# EAGLE design untitled (EAGLE 9.6.2)
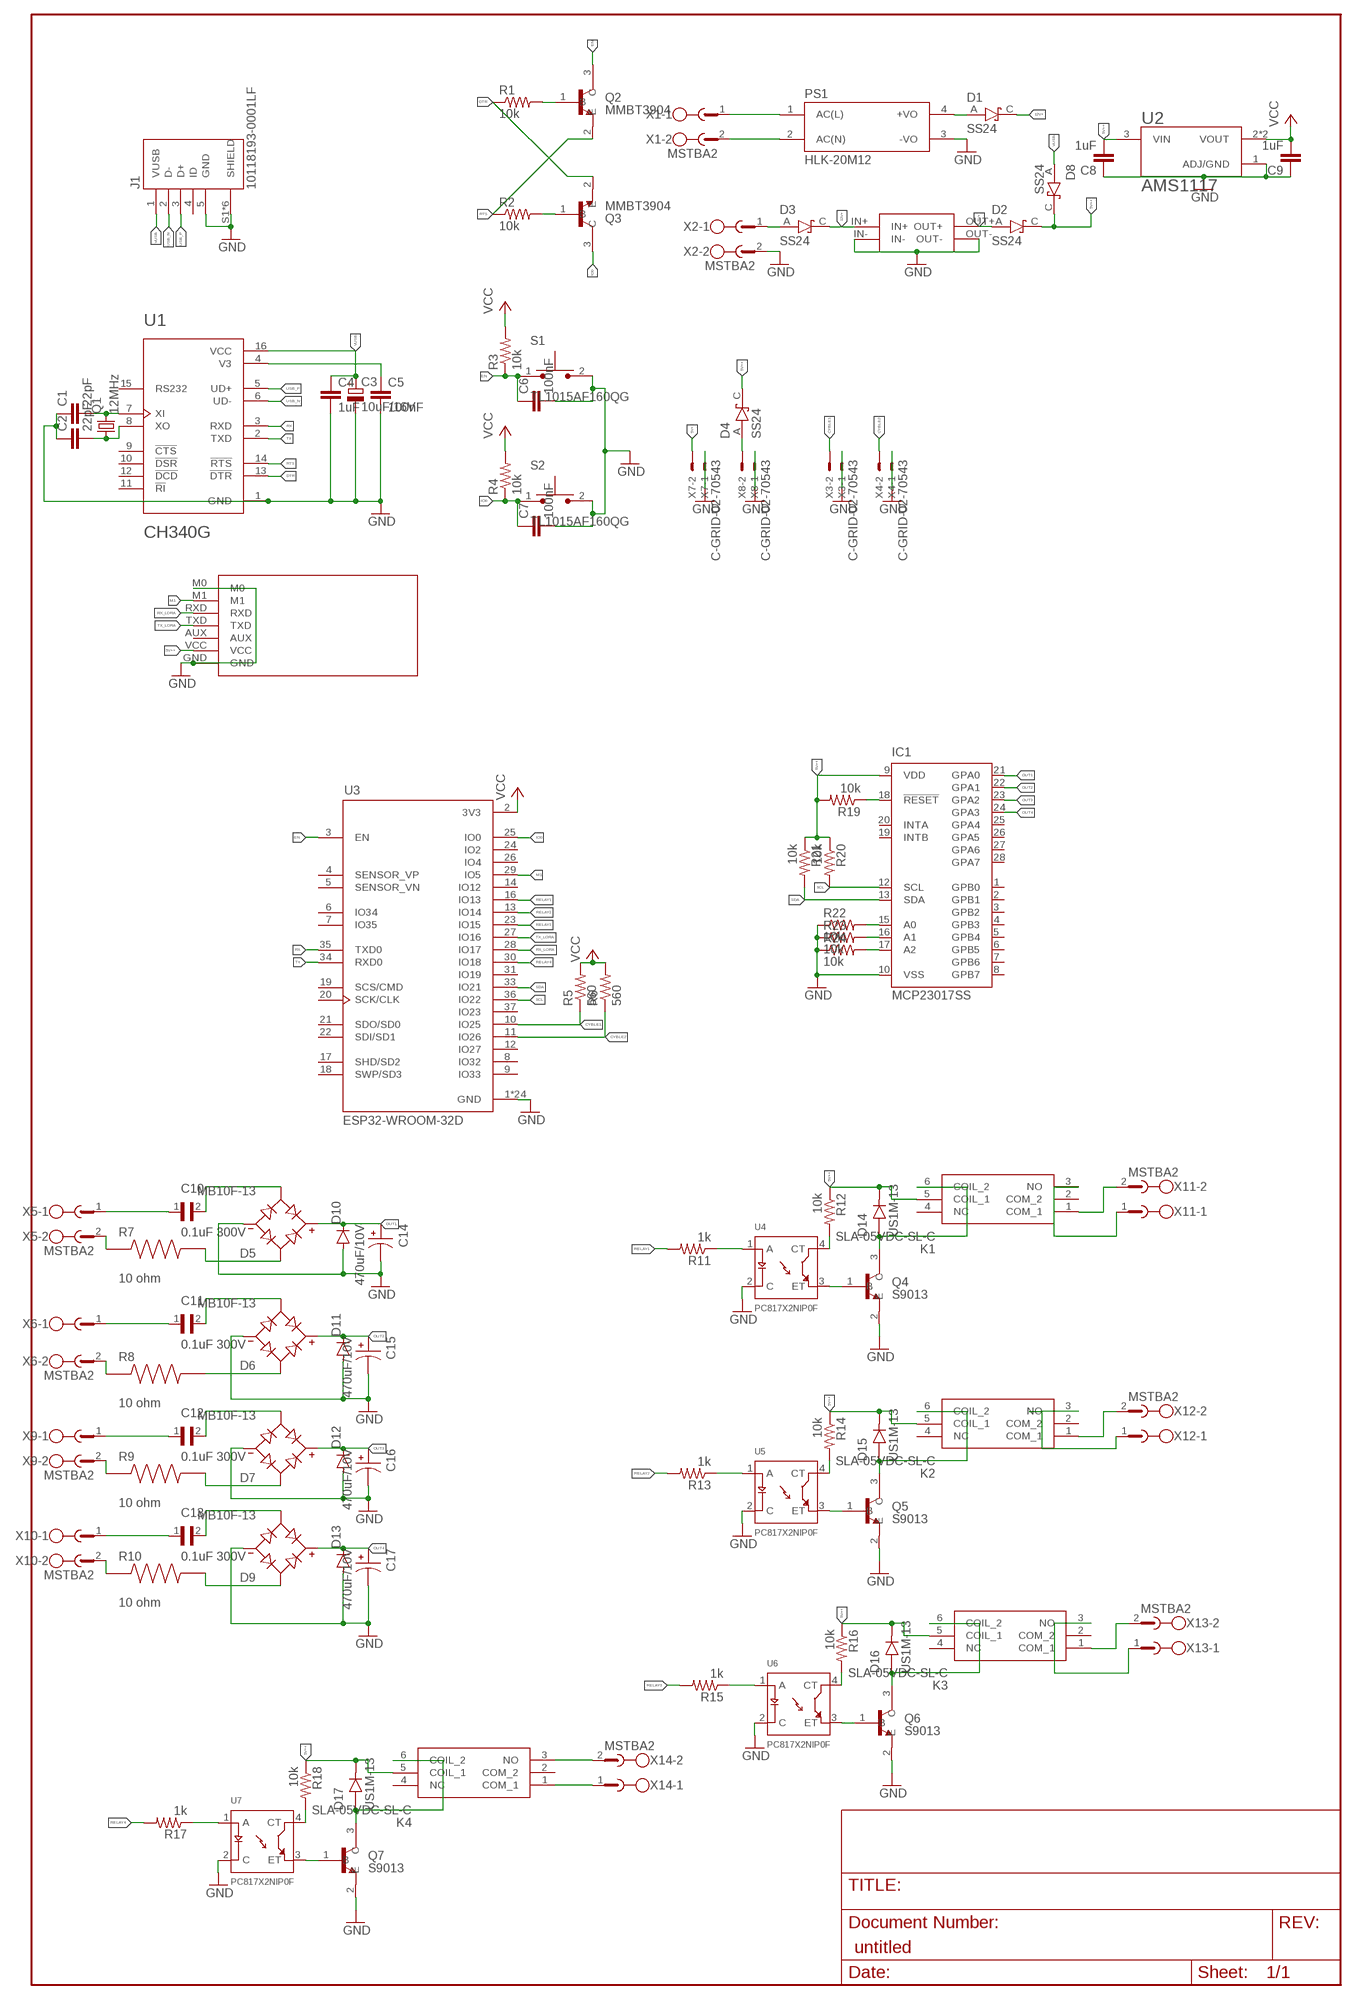
[diagram p0: schematic, sheet 1]

## Parts
C1  22pF  C-EUC0805K  [C0805K]
C2  22pF  C-EUC0805K  [C0805K]
C3  10uF/16V  CPOL-EU153CLV-0505  [153CLV-0505]
C4  1uF  C-EUC0805K  [C0805K]
C5  100nF  C-EUC0805K  [C0805K]
C6  100nF  C-EUC0805K  [C0805K]
C7  100nF  C-EUC0805K  [C0805K]
C8  1uF  C-EUC0805K  [C0805K]
C9  1uF  C-EUC0805K  [C0805K]
C10  0.1uF 300V  ECQUAAF104KA  [CAPRR1500W60L1750T500H1200]
C11  0.1uF 300V  ECQUAAF104KA  [CAPRR1500W60L1750T500H1200]
C12  0.1uF 300V  ECQUAAF104KA  [CAPRR1500W60L1750T500H1200]
C13  0.1uF 300V  ECQUAAF104KA  [CAPRR1500W60L1750T500H1200]
C14  470uF/10V  EEEFC1A471AP  [CAP_EEEFC1A471AP]
C15  470uF/10V  EEEFC1A471AP  [CAP_EEEFC1A471AP]
C16  470uF/10V  EEEFC1A471AP  [CAP_EEEFC1A471AP]
C17  470uF/10V  EEEFC1A471AP  [CAP_EEEFC1A471AP]
D1  SS24  [DIOM5336X265N]
D2  SS24  [DIOM5336X265N]
D3  SS24  [DIOM5336X265N]
D4  SS24  [DIOM5336X265N]
D5  MB10F-13  [DIOB_MB10F-13]
D6  MB10F-13  [DIOB_MB10F-13]
D7  MB10F-13  [DIOB_MB10F-13]
D8  SS24  [DIOM5336X265N]
D9  MB10F-13  [DIOB_MB10F-13]
D10  DIODE-SOD123  [SOD123]
D11  DIODE-SOD123  [SOD123]
D12  DIODE-SOD123  [SOD123]
D13  DIODE-SOD123  [SOD123]
D14  US1M-13  [DIOM5226X240N]
D15  US1M-13  [DIOM5226X240N]
D16  US1M-13  [DIOM5226X240N]
D17  US1M-13  [DIOM5226X240N]
EBYTEE220-900T22D1  EBYTEE220-900T22D  [EBYTEE220-900T22D]
IC1  MCP23017SS  [SSOP28]
J1  10118193-0001LF  [FCI_10118193-0001LF]
K1  SLA-05VDC-SL-C  [SLA05VDCSLC]
K2  SLA-05VDC-SL-C  [SLA05VDCSLC]
K3  SLA-05VDC-SL-C  [SLA05VDCSLC]
K4  SLA-05VDC-SL-C  [SLA05VDCSLC]
MINI1  MINI560  [MINI560]
PS1  HLK-20M12  [CONV_HLK-20M12]
Q1  12MHz  CRYSTALSM49  [SM49]
Q2  MMBT3904  [SOT95P240X120-3N]
Q3  MMBT3904  [SOT95P240X120-3N]
Q4  S9013  [SOT95P240X120-3N]
Q5  S9013  [SOT95P240X120-3N]
Q6  S9013  [SOT95P240X120-3N]
Q7  S9013  [SOT95P240X120-3N]
R1  10k  R-US_M0805  [M0805]
R2  10k  R-US_M0805  [M0805]
R3  10k  R-US_M0805  [M0805]
R4  10k  R-US_M0805  [M0805]
R5  560  R-US_M0805  [M0805]
R6  560  R-US_M0805  [M0805]
R7  10 ohm  ERJP14J200U  [RES_ERJP14J200U]
R8  10 ohm  ERJP14J200U  [RES_ERJP14J200U]
R9  10 ohm  ERJP14J200U  [RES_ERJP14J200U]
R10  10 ohm  ERJP14J200U  [RES_ERJP14J200U]
R11  1k  R-US_M0805  [M0805]
R12  10k  R-US_M0805  [M0805]
R13  1k  R-US_M0805  [M0805]
R14  10k  R-US_M0805  [M0805]
R15  1k  R-US_M0805  [M0805]
R16  10k  R-US_M0805  [M0805]
R17  1k  R-US_M0805  [M0805]
R18  10k  R-US_M0805  [M0805]
R19  10k  R-US_M0805  [M0805]
R20  10k  R-US_M0805  [M0805]
R21  10k  R-US_M0805  [M0805]
R22  10k  R-US_M0805  [M0805]
R23  10k  R-US_M0805  [M0805]
R24  10k  R-US_M0805  [M0805]
S1  TL1015AF160QG  [SW_TL1015AF160QG]
S2  TL1015AF160QG  [SW_TL1015AF160QG]
U1  CH340G  [SOIC127P600X180-16N]
U2  AMS1117  [SOT229P700X180-4N]
U3  ESP32-WROOM-32D  [MODULE_ESP32-WROOM-32D]
U4  PC817X2NIP0F  [SOT254P975X400-4N]
U5  PC817X2NIP0F  [SOT254P975X400-4N]
U6  PC817X2NIP0F  [SOT254P975X400-4N]
U7  PC817X2NIP0F  [SOT254P975X400-4N]
X1  MSTBA2  [MSTBA2]
X2  MSTBA2  [MSTBA2]
X3  C-GRID-02-70543  [70543-02]
X4  C-GRID-02-70543  [70543-02]
X5  MSTBA2  [MSTBA2]
X6  MSTBA2  [MSTBA2]
X7  C-GRID-02-70543  [70543-02]
X8  C-GRID-02-70543  [70543-02]
X9  MSTBA2  [MSTBA2]
X10  MSTBA2  [MSTBA2]
X11  MSTBA2  [MSTBA2]
X12  MSTBA2  [MSTBA2]
X13  MSTBA2  [MSTBA2]
X14  MSTBA2  [MSTBA2]

## Nets
5V+: D2.A MINI1.OUT+ X7.2
5V++: C8.2 D2.C(K) D4.C(K) D8.C(K) D14.C(K) D15.C(K) D16.C(K) D17.C(K) EBYTEE220-900T22D1.VCC IC1.9(VDD) K1.5(COIL_1) K2.5(COIL_1) K3.5(COIL_1) K4.5(COIL_1) R12.1 R14.1 R16.1 R18.1 R19.2 R20.1 R21.1 U2.3(VIN)
12V+: D1.C(K) D3.C(K) MINI1.IN+
CYBLE1: R5.1 U3.10(IO25) X3.2
CYBLE2: R6.1 U3.11(IO26) X4.2
DTR: Q3.2(E) R1.1 U1.13(!DTR)
EN: C6.1 Q2.3(C) R3.1 S1.1 U3.3(EN)
GND: C1.1 C2.1 C3.- C4.2 C5.2 C6.2 C7.2 C8.1 C9.1 C14.2 C15.2 C16.2 C17.2 D5.3(-) D6.3(-) D7.3(-) D9.3(-) D10.A D11.A D12.A D13.A EBYTEE220-900T22D1.GND EBYTEE220-900T22D1.M0 IC1.10(VSS) J1.5(GND) J1.S1(SHIELD) J1.S2(SHIELD) J1.S3(SHIELD) J1.S4(SHIELD) J1.S5(SHIELD) J1.S6(SHIELD) MINI1.IN- MINI1.OUT- PS1.3(-VO) Q4.2(E) Q5.2(E) Q6.2(E) Q7.2(E) R22.1 R23.1 R24.1 S1.2 S2.2 U1.1(GND) U2.1(ADJ/GND) U3.1(GND) U3.15(GND) U3.38(GND) U3.39_1(GND) U3.39_2(GND) U3.39_3(GND) U3.39_4(GND) U3.39_5(GND) U3.39_6(GND) U3.39_7(GND) U3.39_8(GND) U3.39_9(GND) U3.39_10(GND) U3.39_11(GND) U3.39_12(GND) U3.39_13(GND) U3.39_14(GND) U3.39_15(GND) U3.39_16(GND) U3.39_17(GND) U3.39_18(GND) U3.39_19(GND) U3.39_20(GND) U3.39_21(GND) U4.2(C) U5.2(C) U6.2(C) U7.2(C) X2.2 X3.1 X4.1 X7.1 X8.1
IO0: C7.1 Q3.3(C) R4.1 S2.1 U3.25(IO0)
M1: EBYTEE220-900T22D1.M1 U3.29(IO5)
N$1: PS1.1(AC(L)) X1.1
N$2: C5.1 U1.4(V3)
N$3: Q2.1(B) R1.2
N$4: C1.2 Q1.2 U1.7(XI)
N$5: C2.2 Q1.1 U1.8(XO)
N$6: Q3.1(B) R2.2
N$7: PS1.2(AC(N)) X1.2
N$8: C10.1 X5.1
N$9: D1.A PS1.4(+VO)
N$10: D3.A X2.1
N$11: C11.1 X6.1
N$12: D4.A X8.2
N$13: C12.1 X9.1
N$14: C13.1 X10.1
N$15: C10.2 D5.4(AC2)
N$16: C11.2 D6.4(AC2)
N$17: C12.2 D7.4(AC2)
N$18: C13.2 D9.4(AC2)
N$19: R11.1 U4.1(A)
N$20: Q4.1(B) U4.3(ET)
N$21: R12.2 U4.4(CT)
N$22: K1.1(COM_1) X11.2
N$23: K1.3(NO) X11.1
N$24: D14.A K1.6(COIL_2) Q4.3(C)
N$25: IC1.18(!RESET) R19.1
N$26: R13.1 U5.1(A)
N$27: R10.1 X10.2
N$28: R9.1 X9.2
N$29: R8.1 X6.2
N$30: R7.1 X5.2
N$31: D9.2(AC1) R10.2
N$32: D7.2(AC1) R9.2
N$33: D6.2(AC1) R8.2
N$34: D5.2(AC1) R7.2
N$35: Q5.1(B) U5.3(ET)
N$36: R14.2 U5.4(CT)
N$37: D15.A K2.6(COIL_2) Q5.3(C)
N$38: K2.1(COM_1) X12.2
N$39: K2.3(NO) X12.1
N$40: IC1.15(A0) R22.2
N$41: R15.1 U6.1(A)
N$42: Q6.1(B) U6.3(ET)
N$43: R16.2 U6.4(CT)
N$44: D16.A K3.6(COIL_2) Q6.3(C)
N$45: K3.1(COM_1) X13.2
N$46: K3.3(NO) X13.1
N$47: IC1.16(A1) R23.2
N$48: R17.1 U7.1(A)
N$49: Q7.1(B) U7.3(ET)
N$50: R18.2 U7.4(CT)
N$51: D17.A K4.6(COIL_2) Q7.3(C)
N$52: K4.3(NO) X14.2
N$53: K4.1(COM_1) X14.1
N$54: IC1.17(A2) R24.2
OUT1: C14.1 D5.1(+) D10.C IC1.21(GPA0)
OUT2: C15.1 D6.1(+) D11.C IC1.22(GPA1)
OUT3: C16.1 D7.1(+) D12.C IC1.23(GPA2)
OUT4: C17.1 D9.1(+) D13.C IC1.24(GPA3)
RELAY1: R11.2 U3.16(IO13)
RELAY2: R13.2 U3.13(IO14)
RELAY3: R15.2 U3.23(IO15)
RELAY4: R17.2 U3.30(IO18)
RTS: Q2.2(E) R2.1 U1.14(!RTS)
RX: U1.3(RXD) U3.35(TXD0)
RX_LORA: EBYTEE220-900T22D1.RXD U3.28(IO17)
SCL: IC1.12(SCL) R20.2 U3.36(IO22)
SDA: IC1.13(SDA) R21.2 U3.33(IO21)
TX: U1.2(TXD) U3.34(RXD0)
TX_LORA: EBYTEE220-900T22D1.TXD U3.27(IO16)
USB_N: J1.2(D-) U1.6(UD-)
USB_P: J1.3(D+) U1.5(UD+)
VCC: C9.2 R3.2 R4.2 R5.2 R6.2 U2.2(VOUT) U2.4(VOUT) U3.2(3V3)
VUSB: C3.+ C4.1 D8.A J1.1(VUSB) U1.16(VCC)
Unconnected: EBYTEE220-900T22D1.AUX IC1.1(GPB0) IC1.2(GPB1) IC1.3(GPB2) IC1.4(GPB3) IC1.5(GPB4) IC1.6(GPB5) IC1.7(GPB6) IC1.8(GPB7) IC1.19(INTB) IC1.20(INTA) IC1.25(GPA4) IC1.26(GPA5) IC1.27(GPA6) IC1.28(GPA7) J1.4(ID) K1.2(COM_2) K1.4(NC) K2.2(COM_2) K2.4(NC) K3.2(COM_2) K3.4(NC) K4.2(COM_2) K4.4(NC) U1.9(!CTS) U1.10(!DSR) U1.11(!RI) U1.12(!DCD) U1.15(RS232) U3.4(SENSOR_VP) U3.5(SENSOR_VN) U3.6(IO34) U3.7(IO35) U3.8(IO32) U3.9(IO33) U3.12(IO27) U3.14(IO12) U3.17(SHD/SD2) U3.18(SWP/SD3) U3.19(SCS/CMD) U3.20(SCK/CLK) U3.21(SDO/SD0) U3.22(SDI/SD1) U3.24(IO2) U3.26(IO4) U3.31(IO19) U3.37(IO23)

## Library data of the parts
C1 C2 C4-C9 = rcl:C-EU: CAPACITOR, European symbol; SPICEPREFIX: C
C3 = rcl:CPOL-EU: POLARIZED CAPACITOR, European symbol; SPICEPREFIX: C
C10-C13 = ECQUAAF104KA:ECQUAAF104KA: Check availability <https://pricing.snapeda.com/parts/ECQ-UAAF104KA/PANASONIC/view-part?ref=eda>; AVAILABILITY: In Stock; CHECK_PRICES: https://www.snapeda.com/parts/ECQ-UAAF104KA/Panasonic/view-part/?ref=eda; DESCRIPTION: Cap Film Suppression X2 0.1uF 275VAC PP 10% (17.5 X 5 X 12mm) Radial Plastic Rectangular Can 15mm 110C Bulk; MF: PANASONIC; MP: ECQ-UAAF104KA; PACKAGE: DIP-2 Panasonic; PRICE: None; PURCHASE-URL: https://www.snapeda.com/api/url_track_click_mouser/?unipart_id=6218684&manufacturer=PANASONIC&part_name=ECQ-UAAF104KA&search_term=100nf 275vac x2 mpx/dain capacitor; SNAPEDA_LINK: https://www.snapeda.com/parts/ECQ-UAAF104KA/Panasonic/view-part/?ref=snap
C14-C17 = EEEFC1A471AP:EEEFC1A471AP: Check availability <https://pricing.snapeda.com/parts/EEE-FC1A471AP/Panasonic/view-part?ref=eda>; AVAILABILITY: In Stock; CHECK_PRICES: https://www.snapeda.com/parts/EEE-FC1A471AP/Panasonic/view-part/?ref=eda; DESCRIPTION: CAPACITOR ALUM ELEC, 470UF, 10V, 20%, SMD; Product Range:PANASONIC - FC Series; Capacitance:470µF; Capacitance Tolerance:± 20%; Voltage Rating:10V; Diameter:10mm; Height:10.2mm; Life Time @ Temperature:1000 hours @ 105°C ;RoHS Compliant: Yes; MF: Panasonic; MP: EEE-FC1A471AP; PACKAGE: RADIAL-2 Panasonic; PRICE: None; PURCHASE-URL: https://www.snapeda.com/api/url_track_click_mouser/?unipart_id=2309621&manufacturer=Panasonic&part_name=EEE-FC1A471AP&search_term=capasitor smd 470uf 10v dc; SNAPEDA_LINK: https://www.snapeda.com/parts/EEE-FC1A471AP/Panasonic/view-part/?ref=snap
D1-D4 D8 = SS24:SS24: Diode Schottky 40V 2A Surface Mount DO-214AA (SMB) Check availability <https://pricing.snapeda.com/parts/SS24/ON%20Semiconductor/view-part?ref=eda>; AVAILABILITY: In Stock; CHECK_PRICES: https://www.snapeda.com/parts/SS24/Onsemi/view-part/?ref=eda; DESCRIPTION: Diode Schottky 40V 2A Surface Mount DO-214AA (SMB); MF: ON Semiconductor; MP: SS24; PACKAGE: DO-214AA ON Semiconductor; PRICE: None; SNAPEDA_LINK: https://www.snapeda.com/parts/SS24/Onsemi/view-part/?ref=snap
D5-D7 D9 = MB10F-13:MB10F-13: Bridge Rectifier Single Phase Standard 1kV Surface Mount MBF Check availability <https://pricing.snapeda.com/parts/MB10F-13/Diodes%20Inc./view-part?ref=eda>; AVAILABILITY: In Stock; CHECK_PRICES: https://www.snapeda.com/parts/MB10F-13/Diodes+Inc./view-part/?ref=eda; DESCRIPTION: Bridge Rectifier Single Phase Standard 1 kV Surface Mount MBF; MF: Diodes Inc.; MP: MB10F-13; PACKAGE: SMD-4 Diodes Inc.; PRICE: None; PURCHASE-URL: https://www.snapeda.com/api/url_track_click_mouser/?unipart_id=1301322&manufacturer=Diodes Inc.&part_name=MB10F-13&search_term=mb10f; SNAPEDA_LINK: https://www.snapeda.com/parts/MB10F-13/Diodes+Inc./view-part/?ref=snap
D10-D13 = diode:DIODE-: DIODE
D14-D17 = US1M-13:US1M-13: Diode, Fast Recovery, 1a, 1kv, Do-214ac-2, Full Reel Check availability <https://pricing.snapeda.com/parts/US1M-13/Diodes%20Incorporated/view-part?ref=eda>; AVAILABILITY: In Stock; DESCRIPTION: Diode Standard 1000 V 1A Surface Mount SMA; MF: Diodes Incorporated; MP: US1M-13; PACKAGE: DO-214AC-214 Diodes Incorporated; PRICE: None; PURCHASE-URL: https://pricing.snapeda.com/search/part/US1M-13/?ref=eda
EBYTEE220-900T22D1 = EByte E220-900T22D:EBYTEE220-900T22D
IC1 = adafruit:MCP23017: http://ww1.microchip.com/downloads/en/DeviceDoc/21952a.pdf Source: http://ww1.microchip.com/downloads/en/DeviceDoc/21952a.pdf
J1 = 10118193-0001LF:10118193-0001LF: Micro USB B Type Receptacle Check availability <https://pricing.snapeda.com/parts/10118193-0001LF/FCI/view-part?ref=eda>; AVAILABILITY: In Stock; DESCRIPTION: USB - micro B USB 2.0 Receptacle Connector 5 Position Surface Mount, Right Angle; Through Hole; MF: FCI; MP: 10118193-0001LF; PACKAGE: None; PRICE: None; PURCHASE-URL: https://pricing.snapeda.com/search/part/10118193-0001LF/?ref=eda
K1-K4 = SLA-05VDC-SL-C:SLA-05VDC-SL-C: Relays General Purpose Non Latching 5VDC SPDT 30A (250VAC) Max Plugin RoHS Source: Datasheet <https://datasheet.lcsc.com/szlcsc/Ningbo-Songle-Relay-SLA-05VDC-SL-C_C87367.pdf>; DESCRIPTION: Relays General Purpose Non Latching 5VDC SPDT 30A (250VAC) Max Plugin RoHS; HEIGHT: 20.4mm; MANUFACTURER_NAME: Songle Relay; MANUFACTURER_PART_NUMBER: SLA-05VDC-SL-C
MINI1 = MINI560:MINI560
PS1 = HLK-20M12:HLK-20M12: Check availability <https://pricing.snapeda.com/parts/HLK-20M12/Hi-link/view-part?ref=eda>; AVAILABILITY: Not in stock; CHECK_PRICES: https://www.snapeda.com/parts/HLK-20M12/Hi-link/view-part/?ref=eda; DESCRIPTION: 20W ultra-small series module power supply; MF: Hi-link; MP: HLK-20M12; PACKAGE: Non-Standard Hi-link; PRICE: None; SNAPEDA_LINK: https://www.snapeda.com/parts/HLK-20M12/Hi-link/view-part/?ref=snap
Q1 = crystal:CRYSTAL: CRYSTAL; OC_FARNELL: unknown; OC_NEWARK: unknown
Q2 Q3 = MMBT3904:MMBT3904: MMBT3904 Series 40 V CE Breakdown 0.2 A NPN General Purpose Amplifier - SOT-23 Check availability <https://pricing.snapeda.com/parts/MMBT3904/ON%20Semiconductor/view-part?ref=eda>; AVAILABILITY: In Stock; DESCRIPTION: Bipolar (BJT) Transistor NPN 40 V 200 mA 300MHz 300 mW Surface Mount SOT-23-3 (TO-236); MF: ON Semiconductor; MP: MMBT3904; PACKAGE: SOT-23-3 Motorola; PRICE: None
Q4-Q7 = S9013:S9013: SMD Transistors NPN 25V-500mA Check availability <https://pricing.snapeda.com/parts/S9013/JCET/view-part?ref=eda>; AVAILABILITY: In Stock; DESCRIPTION: Bipolar (BJT) Transistor NPN 20V 500mA 625mW Through Hole TO-92-3; MF: JCET; MP: S9013; PACKAGE: SOT-23-3 JCET; PRICE: None; PURCHASE-URL: https://pricing.snapeda.com/search/part/S9013/?ref=eda
R1-R6 R11-R24 = rcl:R-US_: RESISTOR, American symbol; SPICEPREFIX: R
R7-R10 = ERJP14J200U:ERJP14J200U: Check availability <https://pricing.snapeda.com/parts/ERJ-P14J200U/Panasonic/view-part?ref=eda>; AVAILABILITY: In Stock; CHECK_PRICES: https://www.snapeda.com/parts/ERJ-P14J200U/Panasonic/view-part/?ref=eda; DESCRIPTION: RES SMD 20 OHM 5% 1/2W 1210; MF: Panasonic; MP: ERJ-P14J200U; PACKAGE: 3225-2 Panasonic; PRICE: None; PURCHASE-URL: https://www.snapeda.com/api/url_track_click_mouser/?unipart_id=988719&manufacturer=Panasonic&part_name=ERJ-P14J200U&search_term=resistor smd 1210; SNAPEDA_LINK: https://www.snapeda.com/parts/ERJ-P14J200U/Panasonic/view-part/?ref=snap
S1 S2 = TL1015AF160QG:TL1015AF160QG: Tactile Switch SPST-NO Top Actuated Surface Mount Check availability <https://pricing.snapeda.com/parts/TL1015AF160QG/E-Switch/view-part?ref=eda>; AVAILABILITY: In Stock; DESCRIPTION: Tactile Switch SPST-NO Top Actuated Surface Mount; MF: E-Switch; MP: TL1015AF160QG; PACKAGE: None; PRICE: None; PURCHASE-URL: https://pricing.snapeda.com/search/part/TL1015AF160QG/?ref=eda
U1 = CH340G:CH340G: Check availability <https://pricing.snapeda.com/parts/Ch340G/WCH/view-part?ref=eda>; AVAILABILITY: Not in stock; DESCRIPTION: USB Interface Integrated Circuit; MF: WCH; MP: Ch340G; PACKAGE: None; PRICE: None
U2 = AMS1117:AMS1117: Sot223/Pkg 1-Amp 5-Volt Low Drop Out Voltage Regulatator Check availability <https://pricing.snapeda.com/parts/AMS1117/Advanced%20Monolithic%20Systems/view-part?ref=eda>; AVAILABILITY: Not in stock; DESCRIPTION: 1A LOW DROPOUT VOLTAGE REGULATOR SOT-223; MF: Advanced Monolithic Systems; MP: AMS1117; PACKAGE: SOT-223 Seeed Technology; PRICE: None
U3 = ESP32-WROOM-32D:ESP32-WROOM-32D: Bluetooth, WiFi 802.11b/g/n, Bluetooth v4.2 + EDR, Class 1, 2 and 3 Transceiver Module 2.4GHz ~ 2.5GHz Integrated, Trace Surface Mount Check availability <https://pricing.snapeda.com/parts/ESP32-WROOM-32D/Espressif%20Systems/view-part?ref=eda>; AVAILABILITY: In Stock; DESCRIPTION: Bluetooth, WiFi 802.11b/g/n, Bluetooth v4.2 +EDR, Class 1, 2 and 3 Transceiver Module 2.4GHz ~ 2.5GHz Integrated; MF: Espressif Systems; MP: ESP32-WROOM-32D; PACKAGE: Module Espressif Systems; PRICE: None; PURCHASE-URL: https://pricing.snapeda.com/search/part/ESP32-WROOM-32D/?ref=eda
U4-U7 = PC817X2NIP0F:PC817X2NIP0F: PC817 Series 1 Channel 80 V 5000 Vrms General Purpose Photocoupler - DIP-4 Check availability <https://pricing.snapeda.com/parts/PC817X2NIP0F/Sharp%20Microelectronics/view-part?ref=eda>; AVAILABILITY: Not in stock; DESCRIPTION: Optoisolator Transistor Output 5000Vrms 1 Channel 4-SMD; MF: Sharp Microelectronics; MP: PC817X2NIP0F; PACKAGE: SMD-4 Sharp Microelectronics; PRICE: None
X1 X2 X5 X6 X9-X14 = con-phoenix-508:MSTBA2: PHOENIX; MF: FARNELL; MPN: 1757242; OC_FARNELL: 3705171; OC_NEWARK: 71C4161
X3 X4 X7 X8 = con-molex:C-GRID-02: CONNECTOR wire to board 2.54 mm (0.100") pitch header; MF: MOLEX; OC_FARNELL: unknown; OC_NEWARK: unknown

## Board
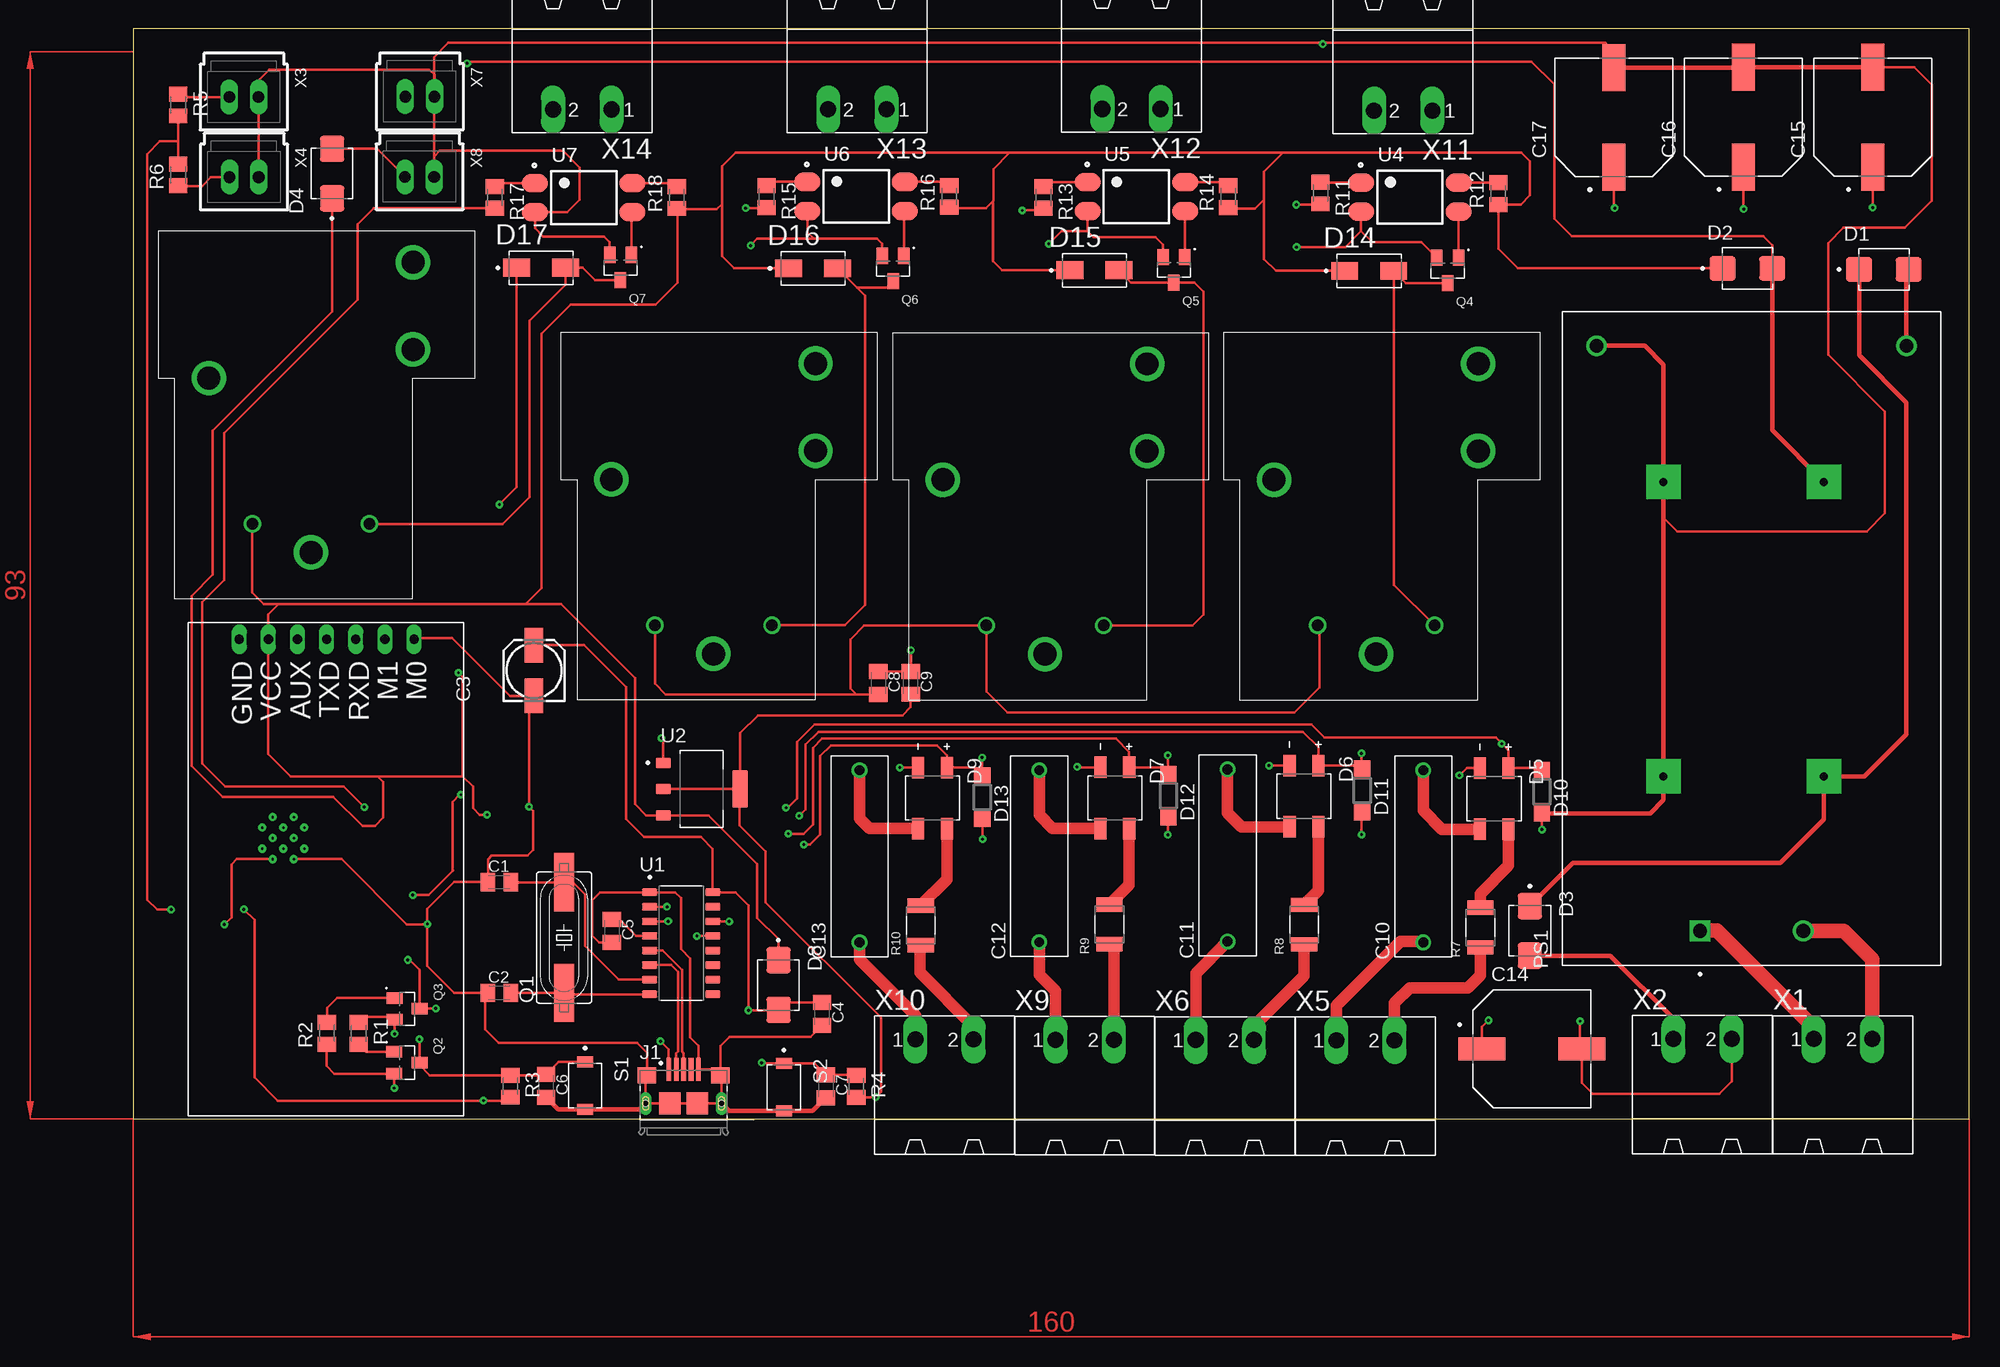
[diagram p1: board, top side]
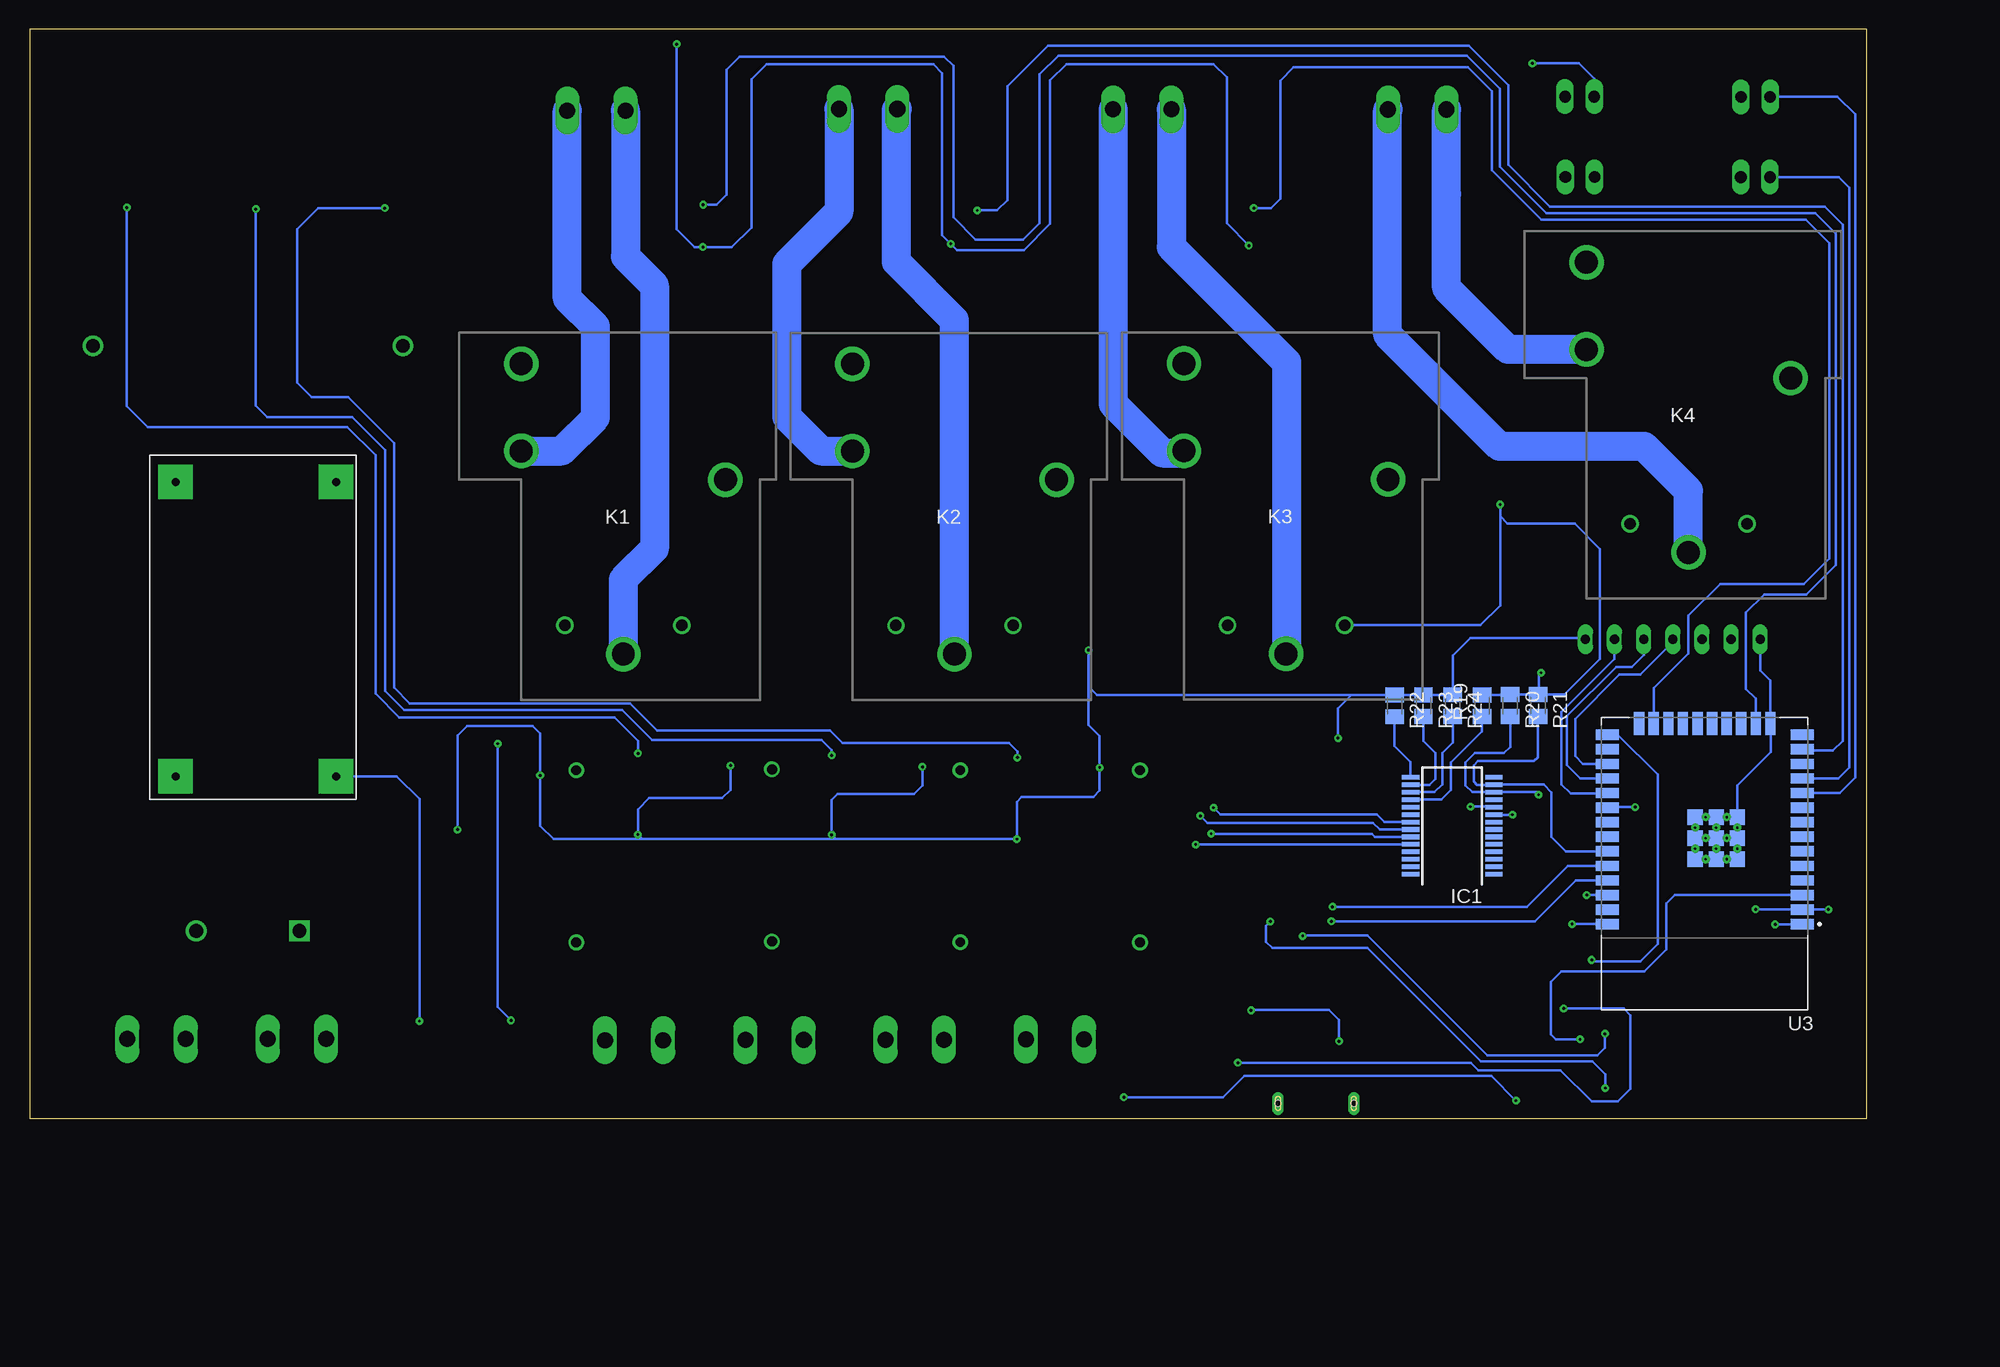
[diagram p2: board, bottom side, seen from below]

Size 160 x 95 mm. Coordinates in mm from the lower left corner, seen from the top.
Outline: 0,0 160,0 160,95 0,95 0,0
Copper layers (1*16): Top 0.035mm / dielectric 1.5mm / Bottom 0.035mm
Design rules "default *": minimum track width 6mil, minimum drill 0.25mm, track to track 6mil, track to pad 6mil, pad to pad 6mil, via to via 6mil, smd to smd 6mil, copper to edge 40mil, drill to drill 6mil, minimum pad ring 10mil, minimum via ring 8mil, stop-mask expansion 4mil, vias tented up to drill 0mil, thermal gap 10mil

### Footprints (pad centres in the part's own frame; a part is rotated, then mirrored left to right if it is on the bottom)
C0805K = smd 1.3 x 1.6: 1 -1,0; 2 1,0
153CLV-0505 = smd 3 x 1.6: + 2.2,0; - -2.2,0
CAPRR1500W60L1750T500H1200 = drill 0.85 pad 1.2: 1 -7.5,0; 2 7.5,0
CAP_EEEFC1A471AP = smd 4.1 x 2: 1 -4.35,0; 2 4.35,0
DIOM5336X265N = smd 2.29 x 2.12: A 2.16,0; C -2.16,0
DIOB_MB10F-13 = smd 1.875 x 1.05: 1 -2.663,1.25; 2 2.663,1.25; 3 -2.663,-1.25; 4 2.663,-1.25
SOD123 = smd 1.4 x 1.4: A 1.9,0; C -1.9,0
DIOM5226X240N = smd 2.33 x 1.55: A 2.135,0; C -2.135,0
EBYTEE220-900T22D = drill 0.8 pad 1.27 long: AUX -4.56,-10.98; GND -4.56,-16.06; M0 -4.56,-0.82; M1 -4.56,-3.36; RXD -4.56,-5.9; TXD -4.56,-8.44; VCC -4.56,-13.52
SSOP28 = smd 0.4 x 1.5: 1 -4.225,-3.625; 2 -3.575,-3.625; 3 -2.925,-3.625; 4 -2.275,-3.625; 5 -1.625,-3.625; 6 -0.975,-3.625; 7 -0.325,-3.625; 8 0.325,-3.625; 9 0.975,-3.625; 10 1.625,-3.625; 11 2.275,-3.625; 12 2.925,-3.625; 13 3.575,-3.625; 14 4.225,-3.625; 15 4.225,3.625; 16 3.575,3.625; 17 2.925,3.625; 18 2.275,3.625; 19 1.625,3.625; 20 0.975,3.625; 21 0.325,3.625; 22 -0.325,3.625; 23 -0.975,3.625; 24 -1.625,3.625; 25 -2.275,3.625; 26 -2.925,3.625; 27 -3.575,3.625; 28 -4.225,3.625
FCI_10118193-0001LF = smd 0.4 x 2: 1 -1.3,2.975; 2 -0.65,2.975; 3 0,2.975; 4 0.65,2.975; 5 1.3,2.975 | smd 1.6 x 1.4: S1 -3.2,2.45; S2 3.2,2.45 | smd 1.9 x 1.9: S3 1.2,0; S4 -1.2,0 | drill 0.5 pad 0.9 long: S5 -3.3,0; S6 3.3,0 | hole 0.5: -3.3,0; 3.3,0
SLA05VDCSLC = drill 2 pad 3: 1 0,0; 2 8.9,15.2; 3 -8.9,17.7; 4 -8.9,25.3 | drill 1 pad 1.5: 5 5.1,2.5; 6 -5.1,2.5
MINI560 = drill 0.7 pad 3 square: IN+ 0,-1.27; IN- 0,-15.24; OUT+ 25.67,-1.27; OUT- 25.67,-15.24
CONV_HLK-20M12 = drill 1.2 square: 1 -25.5,4.5 | drill 1.2: 2 -25.5,-4.5; 3 25.5,13.5; 4 25.5,-13.5
SM49 = smd 5.08 x 1.778: 1 -4.826,0; 2 4.826,0
SOT95P240X120-3N = smd 1 x 1.4: 1 -0.95,-1.1; 2 0.95,-1.1; 3 0,1.1
M0805 = smd 1.3 x 1.6: 1 -0.95,0; 2 0.95,0
RES_ERJP14J200U = smd 1.25 x 2.3: 1 -1.725,0; 2 1.725,0
SW_TL1015AF160QG = smd 0.95 x 1.4: 1 -2.075,0; 2 2.075,0
SOIC127P600X180-16N = smd 1.31 x 0.62: 1 -2.75,4.445; 2 -2.75,3.175; 3 -2.75,1.905; 4 -2.75,0.635; 5 -2.75,-0.635; 6 -2.75,-1.905; 7 -2.75,-3.175; 8 -2.75,-4.445; 9 2.75,-4.445; 10 2.75,-3.175; 11 2.75,-1.905; 12 2.75,-0.635; 13 2.75,0.635; 14 2.75,1.905; 15 2.75,3.175; 16 2.75,4.445
SOT229P700X180-4N = smd 1.31 x 0.93: 1 -3.345,2.29; 2 -3.345,0; 3 -3.345,-2.29 | smd 1.31 x 3.24: 4 3.345,0
MODULE_ESP32-WROOM-32D = smd 2 x 0.9: 1 -8.5,5.26; 2 -8.5,3.99; 3 -8.5,2.72; 4 -8.5,1.45; 5 -8.5,0.18; 6 -8.5,-1.09; 7 -8.5,-2.36; 8 -8.5,-3.63; 9 -8.5,-4.9; 10 -8.5,-6.17; 11 -8.5,-7.44; 12 -8.5,-8.71; 13 -8.5,-9.98; 14 -8.5,-11.25; 25 8.5,-11.25; 26 8.5,-9.98; 27 8.5,-8.71; 28 8.5,-7.44; 29 8.5,-6.17; 30 8.5,-4.9; 31 8.5,-3.63; 32 8.5,-2.36; 33 8.5,-1.09; 34 8.5,0.18; 35 8.5,1.45; 36 8.5,2.72; 37 8.5,3.99; 38 8.5,5.26 | smd 0.9 x 2: 15 -5.715,-12.25; 16 -4.445,-12.25; 17 -3.175,-12.25; 18 -1.905,-12.25; 19 -0.635,-12.25; 20 0.635,-12.25; 21 1.905,-12.25; 22 3.175,-12.25; 23 4.445,-12.25; 24 5.715,-12.25 | smd 1.33 x 1.33: 39_1 -2.835,-0.405; 39_2 -1,-0.405; 39_3 0.835,-0.405; 39_4 -2.835,-2.24; 39_5 -1,-2.24; 39_6 0.835,-2.24; 39_7 -2.835,-4.075; 39_8 -1,-4.075; 39_9 0.835,-4.075 | drill 0.2 pad 0.3: 39_10 -1.917,-0.405; 39_11 -0.083,-0.405; 39_12 -2.835,-1.323; 39_13 -1,-1.323; 39_14 0.835,-1.323; 39_15 -1.917,-2.24; 39_16 -0.083,-2.24; 39_17 -2.835,-3.158; 39_18 -1,-3.158; 39_19 0.835,-3.158; 39_20 -1.917,-4.075; 39_21 -0.083,-4.075
SOT254P975X400-4N = smd 2.25 x 1.6: 1 -4.25,1.27; 2 -4.25,-1.27; 3 4.25,-1.27; 4 4.25,1.27
MSTBA2 = drill 1.397 long: 1 -2.54,5.08; 2 2.54,5.08
70543-02 = drill 1.016 long: 1 -1.27,0; 2 1.27,0

### Placement (x,y rotation side)
C1  31.89,20.61 0 top
C2  31.89,10.96 0 top
C3  34.91,39.06 90 top
C4  60.01,9.14 270 top
C5  41.7,16.37 270 top
C6  35.97,2.86 270 top
C7  60.36,2.82 270 top
C8  64.92,37.98 270 top
C9  67.73,37.99 270 top
C10  112.42,22.86 90 top
C11  95.35,22.94 90 top
C12  78.95,22.87 90 top
C13  63.28,22.86 90 top
C14  121.87,6.08 0 top
C15  151.58,87.27 90 top
C16  140.31,87.28 90 top
C17  129.02,87.26 90 top
D1  152.55,74.02 0 top
D2  140.66,74.11 0 top
D3  121.7,16.36 270 top
D4  17.31,82.37 90 top
D5  118.59,27.89 270 top
D6  102.02,28.11 270 top
D7  85.53,27.95 270 top
D8  56.22,11.64 270 top
D9  69.64,27.94 270 top
D10  122.75,28.5 270 top
D11  107.09,28.6 270 top
D12  90.2,28.14 270 top
D13  73.97,28 270 top
D14  107.69,73.89 0 top
D15  83.75,73.94 0 top
D16  59.23,74.11 0 top
D17  35.52,74.17 0 top
EBYTEE220-900T22D1  25.28,37.22 270 top
IC1  36.07,25.53 90 bottom
J1  47.95,1.32 0 top
K1  108.31,40.49 0 bottom
K2  79.44,40.48 0 bottom
K3  50.55,40.51 0 bottom
K4  15.47,49.34 0 bottom
MINI1  148.59,29.83 90 bottom
PS1  141.03,41.86 90 top
Q1  37.54,15.78 90 top
Q2  23.84,4.87 270 top
Q3  23.85,9.57 270 top
Q4  114.54,73.93 180 top
Q5  90.68,73.98 180 top
Q6  66.21,74.1 180 top
Q7  42.45,74.18 180 top
R1  19.63,7.43 270 top
R2  16.86,7.44 90 top
R3  32.85,2.82 270 top
R4  63,2.81 270 top
R5  3.9,88.35 270 top
R6  3.9,82.26 90 top
R7  117.39,16.65 90 top
R8  102.02,16.9 90 top
R9  85.06,16.93 90 top
R10  68.61,16.84 90 top
R11  103.45,80.67 270 top
R12  118.95,80.62 90 top
R13  79.31,80.29 270 top
R14  95.42,80.37 90 top
R15  55.18,80.35 270 top
R16  71.1,80.38 90 top
R17  31.5,80.29 270 top
R18  47.35,80.28 90 top
R19  33.46,35.99 90 bottom
R20  31.02,36 270 bottom
R21  28.6,36.01 270 bottom
R22  41.09,35.98 270 bottom
R23  38.57,35.99 270 bottom
R24  36.03,35.99 270 bottom
S1  39.36,2.88 270 top
S2  56.69,2.73 270 top
U1  47.74,15.29 0 top
U2  49.52,28.72 0 top
U3  14.06,22.21 180 bottom
U4  111.25,80.32 0 top
U5  87.41,80.36 0 top
U6  62.99,80.37 0 top
U7  39.24,80.27 0 top
X1  148.98,1.86 0 top
X2  136.74,1.87 0 top
X3  9.63,89.04 180 top
X4  9.64,82.06 180 top
X5  107.37,1.75 0 top
X6  95.12,1.77 0 top
X7  24.97,89.07 180 top
X8  24.94,82.08 180 top
X9  82.91,1.8 0 top
X10  70.69,1.83 0 top
X11  110.65,92.95 180 top
X12  86.97,93.08 180 top
X13  63.08,93.05 180 top
X14  39.11,93.04 180 top

### Tracks (layer width: path | path; a pad name or v marks a point on that pad's centre or on a via)
5V+  (via drill 0.25)
  Top 0.203: D2.A 142.82,76.13 142.04,76.91 125.36,76.91 123.83,78.44 123.83,90.15 121.85,92.13 29.24,92.13 v29.08,91.98
  Top 0.406: MINI1.OUT+ 142.82,60 D2.A
  Bottom 0.203: v29.08,91.98 25.02,91.98 23.7,90.66 X7.2
5V++  (via drill 0.25)
  Top 0.203: D2.C 120.64,74.11 118.95,75.81 R12.1 120.91,79.67 121.72,80.48 121.72,83.45 120.98,84.2 100.2,84.2 | 100.2,84.2 98.52,82.52 98.52,80.1 | R14.1 95.53,79.3 97.72,79.3 98.52,80.1 | D14.C 99.56,73.89 98.52,74.93 98.52,80.1 | 100.2,84.2 76.36,84.2 | 76.36,84.2 74.94,82.77 74.94,80 74.92,79.98 | 74.92,79.98 74.3,79.36 71.16,79.36 R16.1 | D15.C 75.71,73.94 74.92,74.74 74.92,79.98 | 76.36,84.2 52.48,84.2 51.29,83.01 51.29,79.71 | 51.29,79.71 50.83,79.25 47.44,79.25 | 47.44,79.25 R18.1 | D16.C 52.36,74.11 51.29,75.18 51.29,79.71 | 33.26,74.03 D17.C 33.39,55.02 v31.89,53.52 | D8.C 56.22,15.66 54.37,17.51 54.37,22.2 50.14,26.43 U2.3 44.7,26.43 43.71,27.41 43.71,38.39 37.25,44.85 34.17,44.85 | 12.66,44.85 11.76,43.94 EBYTEE220-900T22D1.VCC 11.76,31.77 13.69,29.84 21.29,29.84 | 21.29,29.84 21.77,29.36 21.77,26.24 21.06,25.52 19.96,25.52 17.43,28.05 7.78,28.05 5.08,30.75 5.08,45.57 6.93,47.41 6.93,59.97 17.31,70.36 D4.C | v30.82,26.49 30.16,26.49 29.59,27.06 29.59,28.95 28.7,29.84 | 21.29,29.84 28.7,29.84 | 47.44,79.25 47.44,72.86 45.51,70.93 38.08,70.93 35.58,68.42 35.58,46.25 34.17,44.85 | 12.66,44.85 11.37,44.85 10.36,45.86 K4.5 | K3.5 45.45,37.92 46.39,36.98 63.01,36.98 | C8.2 63.01,36.98 | 34.17,44.85 12.66,44.85 | 63.01,36.98 62.49,37.5 62.49,41.78 63.69,42.98 K2.5 74.34,37.21 76.16,35.4 101.17,35.4 103.35,37.58 103.35,42.84 K1.5 | 28.7,29.84 28.7,38.49 v28.32,38.87
  Bottom 0.203: R19.2 31.03,36.94 R20.1 28.61,36.95 R21.1 28.5,36.96 | 28.5,36.96 26.3,36.96 23.18,40.07 23.18,49.65 25.39,51.86 31.24,51.86 31.89,52.5 | v31.89,53.52 31.89,52.5 | IC1.9 32.43,26.49 v30.82,26.49 | K3.5 33.59,43.01 31.89,44.72 31.89,52.5 | v28.32,38.87 28.5,38.69 28.5,36.96
12V+
  Top 0.406: D1.C 150.39,66.53 154.51,62.4 154.51,33.48 150.86,29.83 MINI1.IN+ 147.32,26.08 143.51,22.27 125.44,22.27 D3.C
CYBLE1
  Top 0.203: X3.2 4.16,89.04 R5.1
  Bottom 0.203: U3.10 2.3,28.38 0.93,29.74 0.93,87.52 2.5,89.09 8.31,89.09 X3.2
CYBLE2
  Top 0.203: X4.2 6.75,82.06 5.98,81.29 3.92,81.29 R6.1
  Bottom 0.203: U3.11 2.42,29.65 1.48,30.59 1.48,81.15 2.39,82.06 X4.2
DTR  (via drill 0.25)
  Top 0.203: R1.1 20.12,8.87 22.5,8.87 Q3.2 v22.75,7.39 v22.76,7.38 | v49.09,15.91 49.94,15.91 49.97,15.95 50.47,15.95 U1.13
  Bottom 0.203: v22.75,7.39 22.75,6.19 23.41,5.53 33.01,5.53 43.45,15.97 49.04,15.97 v49.09,15.91
EN  (via drill 0.25)
  Top 0.203: S1.1 37.07,4.96 C6.1 35.89,3.77 R3.1 25.83,3.77 24.94,4.67 Q2.3 24.94,6.9 v24.92,6.92
  Bottom 0.203: v24.92,6.92 27.05,6.92 27.48,7.36 27.48,11.9 26.54,12.84 19.31,12.84 17.41,14.74 17.41,18.75 16.67,19.49 U3.3
GND  (via drill 0.25)
  Top 0.203: J1.S2 51.25,3.68 J1.S6 J1.S3 J1.S4 J1.S5 44.65,3.68 J1.S1 44.75,5.73 43.88,6.59 31.82,6.59 30.66,7.76 30.66,10.96 | J1.S2 50.62,4.3 J1.5 49.25,6.33 48.51,7.06 48.51,13.98 47.71,14.79 47.71,19.22 47.2,19.73 U1.1 40.68,19.73 39.98,19.04 39.98,15.99 40.59,15.37 C5.2 | Q4.2 112.23,76.38 107.97,76.38 107,77.36 | U4.2 107,77.36 | Q5.2 89.73,76.16 89.06,76.83 83.67,76.83 83.16,77.35 | U5.2 83.16,77.35 | Q7.2 41.5,76.4 41.02,76.88 35.71,76.88 34.99,77.61 U7.2 37.81,79 38.89,80.08 38.89,82.89 37.43,84.35 26.7,84.35 26.21,83.86 | Q6.2 65.26,76.24 64.82,76.68 59.3,76.68 | U6.2 58.74,77.24 59.3,76.68 | X8.1 26.21,83.86 | 26.21,83.86 26.21,89.05 X7.1 26.23,90.57 | X4.1 10.91,89.02 | 10.91,89.02 X3.1 | C8.1 67.72,38.98 C9.1 67.75,39.01 v67.75,40.84 | 26.23,90.57 26.23,90.99 25.79,91.43 11.84,91.43 10.91,90.5 10.91,89.02 | C17.2 129.03,93.04 128.29,93.77 103.66,93.77 | 103.66,93.77 27.44,93.77 26.2,92.53 26.2,90.61 26.23,90.57 | C15.2 155.21,91.62 156.73,90.1 156.73,80.02 154.35,77.65 149.03,77.65 147.7,76.32 147.7,66.59 152.65,61.64 152.65,52.77 151.06,51.17 134.55,51.17 133.35,52.37 | X2.2 139.28,3.24 138.21,2.16 127.2,2.16 126.22,3.14 C14.2 126.08,6.23 v126.08,8.5 | D9.3 v66.79,30.59 | v74.01,24.36 74.01,26.07 D13.A | v90.16,24.73 90.16,26.2 D12.A | v107.04,24.76 107.04,26.65 D11.A | v115.56,29.91 116.2,30.55 D5.3 | v122.76,25.2 122.76,26.59 D10.A | D6.3 v98.97,30.77 | D7.3 82.28,30.61 v82.23,30.66 | 25.62,16.98 25.62,18.26 27.97,20.61 C1.1 30.89,22.61 31.22,22.94 34.36,22.94 34.84,23.42 34.84,26.83 v34.47,27.19 34.47,36.42 C3.- 32.83,36.86 27.79,41.9 24.57,41.9 EBYTEE220-900T22D1.M0
  Top 0.203: 25.62,16.98 v25.62,16.96 25.62,13.31 27.97,10.96 30.66,10.96 | C2.1 30.66,10.96 | U3.39_11 18.13,22.61 23.8,16.94 25.58,16.94 25.62,16.98 | J1.S2 51.15,6.33 51.95,7.14 59.01,7.14 C4.2 | U2.1 46.17,33.01 v46.02,33.17 | U3.39_10 9.01,22.61 8.54,22.14 8.54,17.55 v7.92,16.93 | 107,77.36 105.6,75.97 v101.36,75.97 | v103.65,93.66 103.65,93.77 103.66,93.77 | 83.16,77.35 80.87,77.35 v79.77,76.25 | 59.3,76.68 54.37,76.68 v53.79,76.1
  Top 0.406: PS1.3 131.72,67.36 133.35,65.73 MINI1.OUT- 133.35,52.37 MINI1.IN- 133.35,27.77 132.18,26.6 D10.A | C17.2 140.29,91.61 C16.2 151.57,91.64 C15.2 | C6.2 37.02,0.81 S1.2 44.13,0.81 J1.S5 | J1.S6 51.91,0.66 S2.2 59.19,0.66 C7.2
  Bottom 0.203: 11.31,26.28 U3.39_20 U3.39_8 13.12,26.28 | 11.31,26.28 U3.39_7 11.22,29.04 8.3,31.96 8.3,34.42 U3.15 8.34,38.17 9.22,39.05 EBYTEE220-900T22D1.GND | 13.12,26.28 U3.39_21 U3.39_9 U3.39_19 U3.39_6 14.88,24.45 | 13.12,26.28 13.06,26.22 U3.39_18 U3.39_5 | 11.31,26.28 11.22,26.19 U3.39_17 U3.39_4 11.29,24.45 | 11.29,24.45 U3.39_15 U3.39_5 | 13.11,24.45 U3.39_16 14.88,24.45 | 13.11,24.45 U3.39_5 | 14.88,24.45 14.88,23.55 U3.39_14 U3.39_3 U3.39_11 U3.39_2 | 13.11,24.45 13.06,24.4 U3.39_13 U3.39_2 | 11.29,24.45 11.22,24.38 U3.39_12 U3.39_1 U3.39_10 U3.39_2 | EBYTEE220-900T22D1.M0 24.56,41.88 34.49,41.88 36.03,40.35 R24.1 R23.1 R22.1 44.83,36.93 | v126.08,8.5 126.08,27.84 128.07,29.83 MINI1.IN- | 89.78,24.36 v74.01,24.36 74.01,27.62 73.6,28.03 67.35,28.03 66.79,28.59 v66.79,30.59 66.79,33.34 67.75,34.31 67.75,37.68 | 89.78,24.36 v90.16,24.73 90.17,24.75 90.17,27.79 89.65,28.32 82.97,28.32 82.23,29.05 v82.23,30.66 | 89.78,24.36 106.64,24.36 | 106.64,24.36 v107.04,24.76 107.04,26.94 106.05,27.94 99.7,27.94 98.97,28.67 v98.97,30.77 | 106.64,24.36 114.4,24.36 115.56,25.51 v115.56,29.91 115.56,33.57 116.21,34.22 121.93,34.22 122.76,33.39 v122.76,25.2 | 67.75,37.68 v67.75,40.84 | v25.62,16.96 U3.38 | v46.02,33.17 46.02,35.75 44.83,36.93 | 44.83,36.93 67.01,36.93 67.75,37.68 | v34.47,27.19 32.48,27.19 IC1.10 | v7.92,16.93 5.58,16.93 U3.1 | 103.65,93.78 v103.65,93.66 103.65,77.53 102.08,75.97 v101.36,75.97 98.85,75.97 97.14,77.68 97.14,90.58 95.84,91.89 81.29,91.89 80.54,91.13 80.54,77.02 v79.77,76.25 79.24,75.72 73.4,75.72 71.12,77.99 71.12,90.5 69.7,91.92 56.87,91.92 55.72,90.76 55.72,78.03 v53.79,76.1
IO0  (via drill 0.25)
  Top 0.203: R4.1 62.93,3.82 C7.1 59.37,4.81 S2.1 54.81,4.81 v54.74,4.87 | Q3.3 24.95,9.7 | 24.95,9.7 24.95,12.95 24.06,13.83 v23.91,13.83 | v26.35,9.6 25.06,9.6 24.95,9.7
  Bottom 0.203: v23.91,13.83 23.76,13.69 19.68,13.69 18.16,15.21 18.16,29.99 21.62,33.46 U3.25 | v54.74,4.87 34.45,4.87 33.77,4.2 26.62,4.2 23.91,1.49 21.63,1.49 20.54,2.58 20.54,9.01 21.13,9.6 v26.35,9.6
M1
  Bottom 0.203: EBYTEE220-900T22D1.M1 21.92,40.07 26.54,35.45 26.54,29.13 25.75,28.33 22.61,28.33 U3.29
N$1
  Top 1.27: X1.1 146.44,7.94 137.99,16.39 136.56,16.39 PS1.1
N$2
  Top 0.203: U1.4 43.8,15.92 42.35,17.37 C5.1
N$3
  Top 0.203: Q2.1 20.29,5.82 R1.2
N$4
  Top 0.203: U1.7 42.3,12.11 39.38,15.04 39.38,19.53 38.3,20.6 Q1.2 32.9,20.6 C1.2
N$5
  Top 0.203: U1.8 37.64,10.84 Q1.1 C2.2
N$6
  Top 0.203: Q3.1 17.74,10.52 16.86,9.64 R2.2
N$7
  Top 1.27: X1.2 151.53,13.88 149.05,16.36 PS1.2
N$8
  Top 1.016: X5.1 104.83,9.85 110.41,15.44 112.34,15.44 C10.1
N$9
  Top 0.406: PS1.4 154.53,73.83 D1.A
N$10
  Top 0.406: X2.1 134.21,8.72 128.72,14.2 D3.A
N$11
  Top 1.016: X6.1 92.58,12.67 C11.1
N$12
  Top 0.203: X8.2 21.23,84.53 D4.A
N$13
  Top 1.016: X9.1 80.37,11.13 78.95,12.55 C12.1
N$14
  Top 1.016: X10.1 68.15,9.02 63.28,13.88 C13.1
N$15
  Top 1.016: D5.4 114.05,25.23 112.42,26.86 C10.2
N$16
  Top 1.016: D6.4 96.55,25.44 95.35,26.64 C11.2
N$17
  Top 1.016: D7.4 80.12,25.28 78.95,26.45 C12.2
N$18
  Top 1.016: D9.4 64.16,25.27 63.28,26.15 C13.2
N$19
  Top 0.203: U4.1 103.49,81.59 R11.1
N$20
  Top 0.203: Q4.1 115.49,79.04 U4.3
N$21
  Top 0.203: U4.4 118.93,81.59 R12.2
N$22
  Bottom 2.54: X11.2 108.11,75.15 105.59,72.62 105.59,49.68 108.31,46.97 K1.1
N$23
  Bottom 2.54: K1.3 113.67,58.19 110.74,61.11 110.74,69.03 113.19,71.48 X11.1
N$24
  Top 0.203: D14.A 109.87,73.85 | 109.87,73.85 110.89,72.83 Q4.3 | 109.87,73.85 109.87,58.69 109.87,58.4 109.87,46.52 K1.6
N$25
  Bottom 0.203: IC1.18 37.01,27.8 36.18,28.63 36.18,31.03 33.47,33.74 R19.1
N$26
  Top 0.203: R13.1 79.7,81.63 U5.1
N$27
  Top 1.016: X10.2 73.23,8.05 68.56,12.72 68.56,15.06 R10.1
N$28
  Top 1.016: X9.2 85.45,14.82 R9.1
N$29
  Top 1.016: X6.2 97.66,8.1 102.02,12.45 R8.1
N$30
  Top 1.016: X5.2 109.91,10.08 111.24,11.41 116.32,11.41 117.39,12.48 R7.1
N$31
  Top 1.016: R10.2 70.89,20.84 D9.2
N$32
  Top 1.016: R9.2 86.78,20.38 D7.2
N$33
  Top 1.016: R8.2 103.27,19.88 D6.2
N$34
  Top 1.016: R7.2 117.39,19.6 119.84,22.05 D5.2
N$35
  Top 0.203: Q5.1 91.63,79.06 U5.3
N$36
  Top 0.203: R14.2 95.11,81.63 U5.4
N$37
  Top 0.203: D15.A 86.95,72.88 Q5.3 92.49,72.88 93.27,72.09 93.27,43.94 92.31,42.98 K2.6
N$38
  Bottom 2.54: K2.1 79.44,69.61 84.51,74.67 84.51,87.92 X12.2
N$39
  Bottom 2.54: X12.1 89.51,79.05 94.07,74.48 94.07,61.17 91.09,58.18 K2.3
N$40
  Bottom 0.203: IC1.15 39.7,31.1 41.09,32.49 R22.2
N$41
  Top 0.203: R15.1 55.52,81.64 U6.1
N$42
  Top 0.203: Q6.1 67.16,79.02 U6.3
N$43
  Top 0.203: R16.2 70.78,81.64 U6.4
N$44
  Top 0.203: Q6.3 65.62,72.41 63.06,72.41 | 61.38,74.09 D16.A 63.06,72.41 | K3.6 62.01,43.01 63.77,44.77 63.77,71.71 63.06,72.41
N$45
  Bottom 2.54: X13.2 60.54,75.97 50.51,65.95 50.51,40.55 K3.1
N$46
  Bottom 2.54: X13.1 65.62,62.32 61.32,58.02 59.64,58.02 K3.3
N$47
  Bottom 0.203: IC1.16 38.04,29.1 37.54,29.6 37.54,31.87 38.58,32.9 R23.2
N$48
  Top 0.203: R17.1 31.8,81.54 U7.1
N$49
  Top 0.203: Q7.1 43.4,78.91 U7.3
N$50
  Top 0.203: R18.2 47.05,81.54 U7.4
N$51
  Top 0.203: K4.6 20.61,51.8 31.01,51.8 32.17,51.8 34.52,54.16 34.52,69.55 37.66,72.69 D17.A | D17.A | Q7.3 40.25,73.08 39.14,74.19 37.69,74.19 D17.A
N$52
  Bottom 2.54: X14.2 36.57,80.59 36.57,72.41 31.21,67.04 K4.3
N$53
  Bottom 2.54: X14.1 41.71,87.9 41.71,68.34 31.94,58.58 19.32,58.58 15.47,54.72 K4.1
N$54
  Bottom 0.203: IC1.17 37.61,28.45 36.94,29.12 36.94,31.85 36.03,32.77 R24.2
OUT1  (via drill 0.25)
  Top 0.203: D10.C 122.59,30.55 D5.1 119.84,32.08 v119.25,32.68 118.73,33.2 103.81,33.2 102.67,34.33 59.37,34.33 57.85,32.82 57.85,27.92 57.03,27.1 v56.87,27.1 | C14.1 117.52,8 v118.09,8.56
  Bottom 0.203: v56.87,27.1 56.27,26.5 42.63,26.5 41.98,25.85 IC1.21 | v118.09,8.56 119.27,9.74 119.27,32.66 v119.25,32.68
OUT2  (via drill 0.25)
  Top 0.203: 107.03,30.56 106.82,30.77 D6.1 103.27,32.39 101.93,33.72 59.69,33.72 58.58,32.61 58.58,26.95 v58.01,26.38 | C15.1 151.58,79.54 151.64,79.48 v151.57,79.41 | v107.03,31.84 107.03,30.56 | 107.03,30.56 D11.C
  Bottom 0.203: v58.01,26.38 57.42,25.79 42.97,25.79 42.37,25.19 IC1.22 | v151.57,79.41 151.57,62.09 149.78,60.29 132.37,60.29 129.91,57.83 129.91,37.05 127.84,34.98 109.09,34.98 107.03,32.92 v107.03,31.84
OUT3  (via drill 0.25)
  Top 0.203: D12.C 89.97,30.26 | 89.97,30.26 89.62,30.61 D7.1 86.78,31.96 85.61,33.12 60.01,33.12 59.21,32.32 59.21,25.64 58.4,24.83 v57.07,24.83 | C16.1 140.31,79.32 v140.34,79.28 | v90.15,31.66 90.15,30.44 89.97,30.26
  Bottom 0.203: v57.07,24.83 43.08,24.83 42.8,24.55 IC1.23 | v140.34,79.28 140.34,62.14 139.35,61.15 131.95,61.15 129.06,58.26 129.06,37.26 127.42,35.62 108.42,35.62 105.8,33 91.02,33 90.15,32.14 v90.15,31.66
OUT4  (via drill 0.25)
  Top 0.203: D13.C 73.85,30.03 | 73.85,30.03 73.28,30.6 D9.1 70.89,31.67 70.02,32.54 60.78,32.54 59.85,31.6 59.85,24.78 58.96,23.89 v58.43,23.89 | C17.1 129.03,79.51 129.13,79.4 v129.09,79.36 | v73.96,31.47 73.96,30.14 73.85,30.03
  Bottom 0.203: v58.43,23.89 39.71,23.89 IC1.24 | v129.09,79.36 134.91,79.36 136.73,77.54 136.73,64.16 135.47,62.89 132.3,62.89 128.3,58.89 128.3,37.56 126.94,36.19 107.71,36.19 105.34,33.83 90.27,33.83 89.19,32.75 74.7,32.75 73.94,32 73.94,31.49 v73.96,31.47
RELAY1  (via drill 0.25)
  Top 0.203: R11.2 103.39,79.66 v101.35,79.66
  Bottom 0.203: v101.35,79.66 100.16,79.66 99.3,80.52 99.3,91.44 98.17,92.56 80.34,92.56 79.54,91.76 79.54,78.55 77.59,76.61 73.47,76.61 72.02,78.06 72.02,91.03 70.4,92.64 34.77,92.64 31.91,89.78 31.91,82.97 27.87,78.94 4.42,78.94 2.64,77.16 2.64,48.27 5.21,45.7 8.86,45.7 10.46,44.1 10.46,37.46 9.61,36.62 U3.16
RELAY2  (via drill 0.25)
  Top 0.203: R13.2 79.14,79.16 v77.46,79.16
  Bottom 0.203: v77.46,79.16 75.73,79.16 74.82,80.07 74.82,90 71.31,93.52 34.64,93.52 31.18,90.06 31.18,83.15 27.54,79.5 3.61,79.5 2.04,77.93 2.04,32.93 2.88,32.09 5.46,32.09 U3.13
RELAY3  (via drill 0.25)
  Top 0.203: R15.2 55.13,79.36 v53.35,79.36
  Bottom 0.203: v53.35,79.36 51.87,79.36 51.05,80.18 51.05,90.46 49.89,91.62 34.69,91.62 32.6,89.53 32.6,82.66 28.29,78.35 5.26,78.35 3.22,76.31 3.22,48.82 5.42,46.62 12.71,46.62 15.48,43.84 15.48,40.55 18.5,37.52 U3.23
RELAY4  (via drill 0.25)
  Top 0.203: v20.11,27.16 18.31,28.96 7.98,28.96 5.99,30.96 5.99,45.02 7.92,46.95 7.92,59.75 19.55,71.38 19.55,77.97 20.92,79.34 R17.2
  Bottom 0.203: v20.11,27.16 22.5,27.16 U3.30
RTS  (via drill 0.25)
  Top 0.203: R2.1 16.83,6.46 16.83,4.6 17.51,3.92 Q2.2 v22.74,2.66 v22.73,2.65 | v51.92,17.18 50.51,17.18 U1.14
  Bottom 0.203: v22.73,2.65 22.73,3.87 23.83,4.97 33.55,4.97 43.44,14.86 51.74,14.86 52.28,15.4 52.28,16.82 v51.92,17.18
RX  (via drill 0.25)
  Top 0.203: v46.59,17.19 U1.3
  Bottom 0.203: U3.35 25.3,20.76 28.86,17.19 v46.59,17.19
RX_LORA
  Bottom 0.203: EBYTEE220-900T22D1.RXD 19.38,40.41 20.41,39.37 21.77,39.37 26.07,35.07 26.07,30.82 24.9,29.65 U3.28
SCL  (via drill 0.25)
  Top 0.203: v24.35,19.49 25.72,19.49 27.82,21.59 | 27.82,21.59 27.88,21.64 | 27.82,21.59 27.82,27.62 28.44,28.24 v28.54,28.24
  Bottom 0.203: R20.2 31.02,32.4 31.55,31.87 34.09,31.87 34.91,31.05 34.91,29.04 34.32,28.45 IC1.12 28.75,28.45 v28.54,28.24 | U3.36 v24.35,19.49
SDA
  Bottom 0.203: IC1.13 32.69,29.1 | 32.69,29.1 33.92,29.1 34.2,29.38 34.2,30.78 33.83,31.15 28.94,31.15 28.6,31.49 R21.2 | U3.33 26.15,23.3 27.41,24.56 27.41,28.43 28.08,29.1 32.69,29.1
TX  (via drill 0.25)
  Top 0.203: v46.49,18.45 45,18.45 U1.2
  Bottom 0.203: U3.34 26,22.03 29.57,18.45 v46.49,18.45
TX_LORA
  Bottom 0.203: EBYTEE220-900T22D1.TXD 16.84,41.56 19.69,38.7 21.5,38.7 25.36,34.85 25.36,31.61 24.66,30.92 U3.27
USB_N
  Top 0.203: J1.2 47.3,5.71 47.45,5.85 47.45,12.8 46.84,13.41 45.02,13.41 U1.6
USB_P
  Top 0.203: J1.3 47.95,5.71 47.8,5.85 47.8,12.95 46.1,14.65 U1.5
VCC  (via drill 0.25)
  Top 0.203: R6.2 3.9,85.05 | 3.9,85.05 R5.2 | U2.2 U2.4 | R3.2 32.54,1.57 v30.51,1.57 12.58,1.57 10.56,3.59 10.56,17.31 v9.62,18.24 | U2.4 52.87,33.59 54.42,35.15 67.01,35.15 67.75,35.88 67.75,36.97 C9.2 | R4.2 v64.68,1.86 65.14,2.32 65.14,8.82 55.11,18.85 55.11,23.29 52.84,25.56 52.84,28.7 U2.4 | v3.28,18.23 2.06,18.23 1.21,19.07 1.21,84.08 2.31,85.17 3.77,85.17 3.9,85.05
  Bottom 0.203: v9.62,18.24 5.58,18.24 U3.2 3.28,18.22 v3.28,18.23 | v64.68,1.86 56.04,1.86 54.18,3.72 32.67,3.72 30.51,1.56 v30.51,1.57
VUSB  (via drill 0.25)
  Top 0.203: C4.1 56.87,10.14 D8.A 56.17,9.43 v53.6,9.43 53.6,18.6 52.47,19.73 U1.16 50.49,23.5 49.46,24.54 44.51,24.54 42.95,26.1 42.95,37.6 39.27,41.28 34.93,41.28 C3.+ | J1.1 46.65,6.03 v45.94,6.74
  Bottom 0.203: v45.94,6.74 45.94,8.61 46.81,9.48 53.56,9.48 v53.6,9.43
(copper drawn outside any net)
  shapes: Top area x2